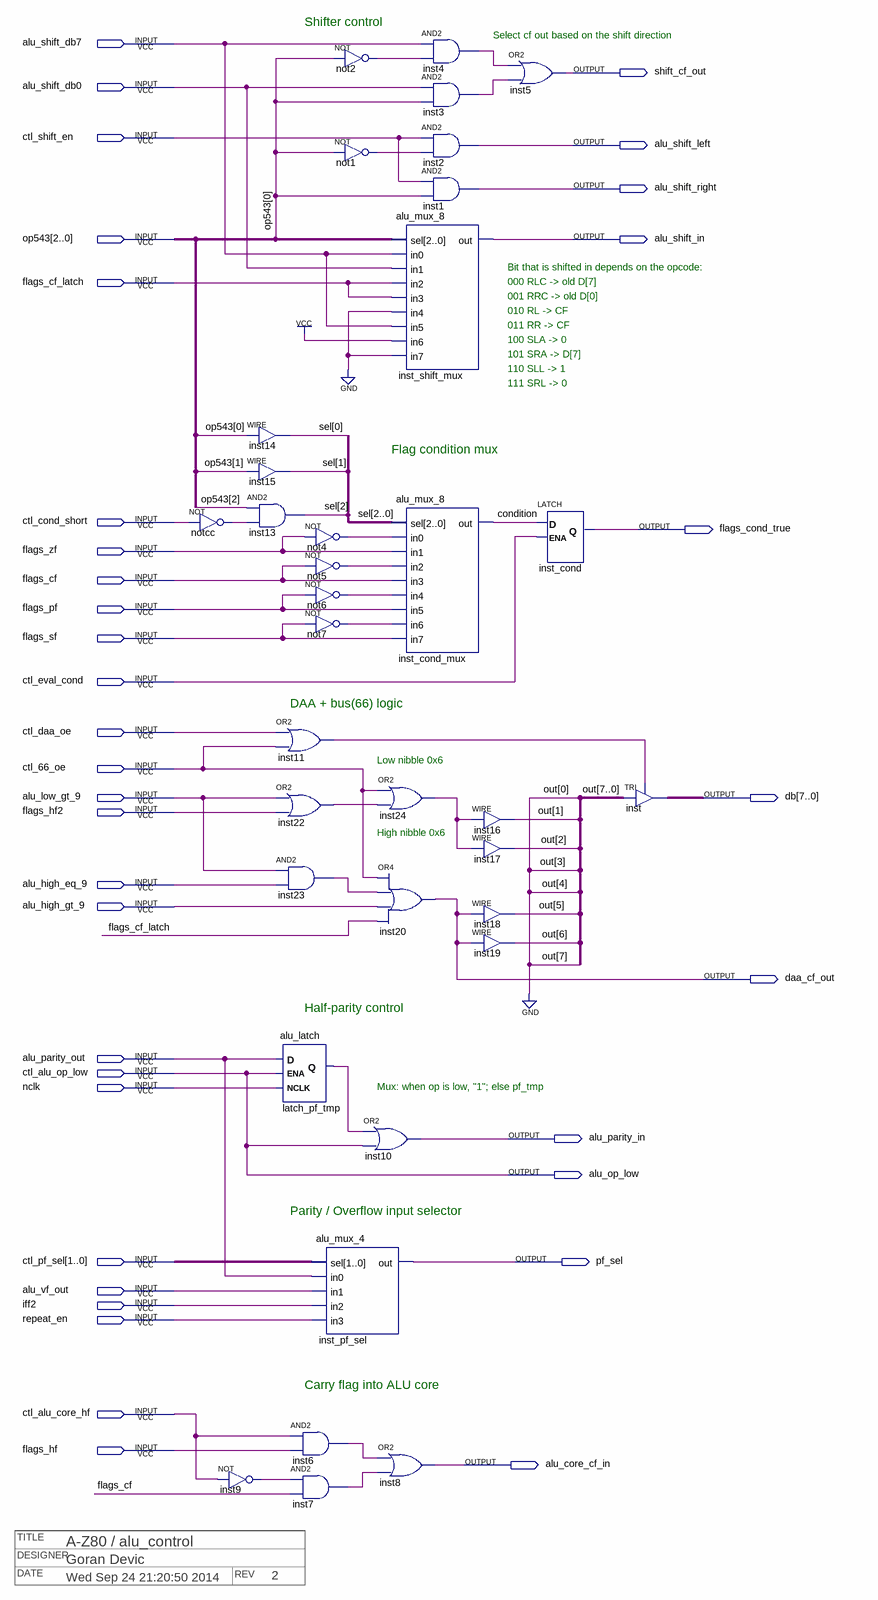
[diagram p0: schematic sheet]
// Quartus schematic alu_control.bdf as structural Verilog: 35 symbols, 37 pins
// Title block: DATE: Wed Sep 24 21:20:50 2014; DESIGNER: Goran Devic; REV: 2; TITLE: A-Z80 / alu_control
module alu_control (
  input  alu_shift_db7,
  input  alu_shift_db0,
  input  ctl_shift_en,
  input  [2:0] op543,
  input  flags_cf_latch,
  input  ctl_cond_short,
  input  flags_zf,
  input  flags_cf,
  input  flags_pf,
  input  flags_sf,
  input  ctl_eval_cond,
  input  ctl_daa_oe,
  input  ctl_66_oe,
  input  alu_low_gt_9,
  input  flags_hf2,
  input  alu_high_eq_9,
  input  alu_high_gt_9,
  input  alu_parity_out,
  input  ctl_alu_op_low,
  input  nclk,
  input  [1:0] ctl_pf_sel,
  input  alu_vf_out,
  input  iff2,
  input  repeat_en,
  input  ctl_alu_core_hf,
  input  flags_hf,
  output shift_cf_out,
  output alu_shift_left,
  output alu_shift_right,
  output alu_shift_in,
  output flags_cond_true,
  output [7:0] db,
  output daa_cf_out,
  output alu_parity_in,
  output alu_op_low,
  output pf_sel,
  output alu_core_cf_in
);

  wire condition, inst3_out, inst4_out, inst6_out, inst7_out, inst9_out, inst11_out, inst22_out, inst23_out,
       inst24_out, latch_pf_tmp_q, not1_out, not2_out, not4_out, not5_out, not6_out, not7_out, notcc_out;
  wire [2:0] sel;
  wire [6:1] out;

  not notcc (notcc_out, ctl_cond_short);
  assign sel[0] = op543[0];  // WIRE inst14
  assign sel[1] = op543[1];  // WIRE inst15
  and inst13 (sel[2], op543[2], notcc_out);
  not inst9 (inst9_out, ctl_alu_core_hf);
  not not4 (not4_out, flags_zf);
  not not5 (not5_out, flags_cf);
  not not6 (not6_out, flags_pf);
  not not7 (not7_out, flags_sf);
  or inst11 (inst11_out, ctl_daa_oe, ctl_66_oe);
  or inst22 (inst22_out, alu_low_gt_9, flags_hf2);
  and inst23 (inst23_out, alu_low_gt_9, alu_high_eq_9);
  alu_latch latch_pf_tmp (.D(alu_parity_out), .ENA(ctl_alu_op_low), .NCLK(nclk), .Q(latch_pf_tmp_q));
  alu_mux_4 inst_pf_sel (
    .sel(ctl_pf_sel), .in0(alu_parity_out), .in1(alu_vf_out), .in2(iff2), .in3(repeat_en), .out(pf_sel));
  and inst6 (inst6_out, ctl_alu_core_hf, flags_hf);
  and inst7 (inst7_out, inst9_out, flags_cf);
  not not2 (not2_out, op543[0]);
  not not1 (not1_out, op543[0]);
  or inst24 (inst24_out, ctl_66_oe, inst22_out);
  or inst20 (daa_cf_out, ctl_66_oe, inst23_out, alu_high_gt_9, flags_cf_latch);
  or inst10 (alu_parity_in, latch_pf_tmp_q, ctl_alu_op_low);
  or inst8 (alu_core_cf_in, inst6_out, inst7_out);
  and inst4 (inst4_out, alu_shift_db7, not2_out);
  and inst3 (inst3_out, alu_shift_db0, op543[0]);
  and inst2 (alu_shift_left, ctl_shift_en, not1_out);
  and inst1 (alu_shift_right, ctl_shift_en, op543[0]);
  alu_mux_8 inst_shift_mux (
    .sel(op543), .in0(alu_shift_db7), .in1(alu_shift_db0), .in2(flags_cf_latch), .in3(flags_cf_latch),
    .in4(1'b0), .in5(alu_shift_db7), .in6(1'b1), .in7(1'b0), .out(alu_shift_in));
  alu_mux_8 inst_cond_mux (
    .sel(sel), .in0(not4_out), .in1(flags_zf), .in2(not5_out), .in3(flags_cf), .in4(not6_out),
    .in5(flags_pf), .in6(not7_out), .in7(flags_sf), .out(condition));
  assign out[1] = inst24_out;  // WIRE inst16
  assign out[2] = inst24_out;  // WIRE inst17
  assign out[5] = daa_cf_out;  // WIRE inst18
  assign out[6] = daa_cf_out;  // WIRE inst19
  or inst5 (shift_cf_out, inst4_out, inst3_out);
  LATCH inst_cond (.D(condition), .ENA(ctl_eval_cond), .Q(flags_cond_true));
  TRI inst[7:0] (.IN({1'b0, out[6:5], 2'b00, out[2:1], 1'b0}), .OE(inst11_out), .OUT(db));

  assign alu_op_low = ctl_alu_op_low;

  // Notes on the sheet:
  //   Shifter control
  //   Select cf out based on the shift direction
  //   Bit that is shifted in depends on the opcode:
  //   000 RLC -> old D[7]
  //   001 RRC -> old D[0]
  //   010 RL -> CF
  //   011 RR -> CF
  //   100 SLA -> 0
  //   101 SRA -> D[7]
  //   110 SLL -> 1
  //   111 SRL -> 0
  //   Flag condition mux
  //   DAA + bus(66) logic
  //   Low nibble 0x6
  //   High nibble 0x6
  //   Half-parity control
  //   Mux: when op is low, "1"; else pf_tmp
  //   Parity / Overflow input selector
  //   Carry flag into ALU core
endmodule
